# Altium schematic sheet 300mV_Reference_Voltage.SchDoc
size A4
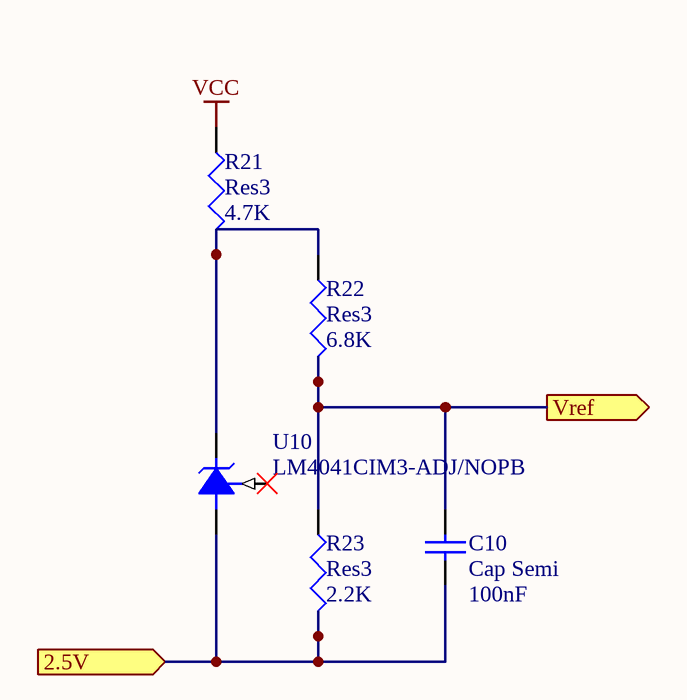
[diagram p0: 300mV_Reference_Voltage.SchDoc]

## Parts
C10  Cap Semi  value 100nF  [C1206]
R21  Res3  value 4.7K  [J1-0603]
R22  Res3  value 6.8K  [J1-0603]
R23  Res3  value 2.2K  [J1-0603]
U10  LM4041CIM3-ADJ/NOPB  [MF03A_M]

## Ports
2.5V (in), Vref (out)

## Nets
VCC: R21.1
2.5V: C10.1 R23.2 U10.3(-V) ; port 2.5V
Vref: C10.2 R22.2 R23.1 ; port Vref
NetR21_2: R21.2 R22.1 U10.2(+V)

Not connected (* = marked no-connect by the designer): U10 1(FB)*

## Library data of the parts
C10 = Cap Semi: Capacitor (Semiconductor SIM Model); Published: 8-Jun-2000; LatestRevisionDate: 29-May-2009; LatestRevisionNote: IPC-7351 Footprint Added.; PackageReference: C1206; Publisher: Altium Limited; PackageDescription: Chip Capacitor
R21-R23 = Res3: Resistor; Published: 8-Jun-2000; LatestRevisionDate: 29-May-2009; LatestRevisionNote: IPC-7351 Footprint Added.; PackageReference: J1-0603; Publisher: Altium Limited; PackageDescription: Chip Resistor
U10 = CMP-0074-00728-2: Precision Micropower Shunt Voltage Reference, 3-pin SOT-23, Pb-Free; Manufacturer: National Semiconductor; PowerWise: N; CompType: Voltage Reference IC; PackageTopMarking: RAC*XTT; DatasheetVersion: Mar-2005; PackageVersion: revB, Mar-2003; ComponentLink1URL: http://www.national.com/ds/LM/LM4041.pdf; RevisionNote: Component URLs added; RoHS: Y; PackageDescription: Molded SOT-23, .115 x .051 x .037in Body, 3 Lead, .075 in Pitch; ComponentLink1Description: LM4041 Datasheet; PackageReference: MF03A; ComponentLink2URL: http://www.national.com/pf/LM/LM4041.html; ComponentLink3URL: http://www.national.com/packaging/folders/mf03a.html; ComponentLink2Description: LM4041 Web Page; PinCount: 3; ComponentLink3Description: MF03A Package Page